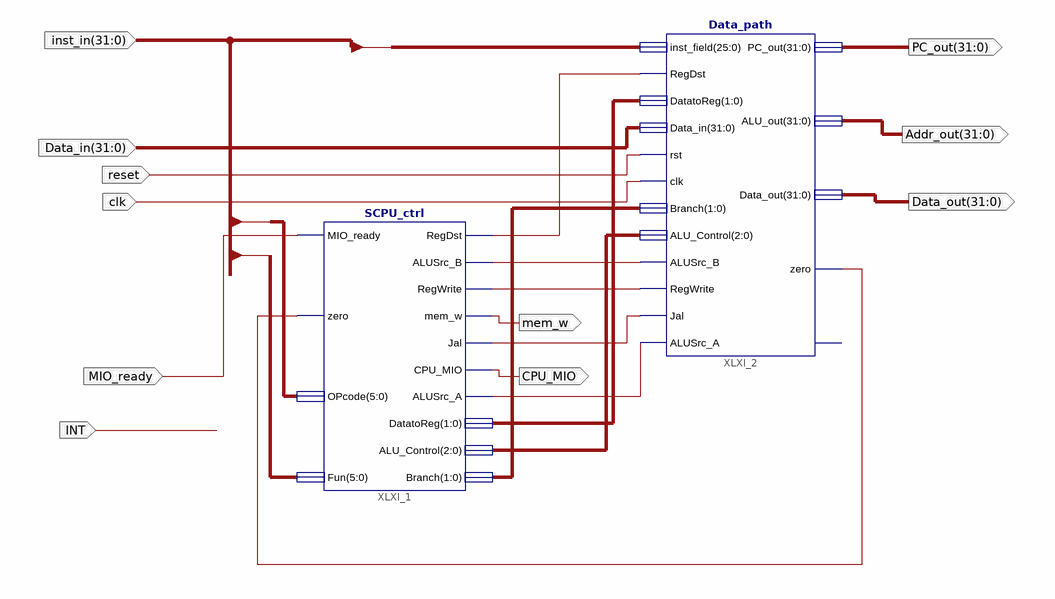
[diagram p0: schematic sheet 1]
// Xilinx ISE schematic SCPU_More.sch (kintex7) as structural Verilog: 2 symbols, 11 ports
module SCPU_More (
  input  clk,
  input  reset,
  input  [31:0] Data_in,
  input  [31:0] inst_in,
  input  INT,
  input  MIO_ready,
  output mem_w,
  output CPU_MIO,
  output [31:0] Addr_out,
  output [31:0] Data_out,
  output [31:0] PC_out
);

  wire XLXN_30, XLXN_32, XLXN_33, XLXN_34, XLXN_35, zero;
  wire [1:0] XLXN_36, XLXN_38;
  wire [2:0] XLXN_37;

  SCPU_ctrl XLXI_1 (
    .MIO_ready(MIO_ready), .zero(zero), .OPcode(inst_in[31:26]), .Fun(inst_in[5:0]), .RegDst(XLXN_30),
    .ALUSrc_B(XLXN_32), .RegWrite(XLXN_33), .mem_w(mem_w), .Jal(XLXN_34), .CPU_MIO(CPU_MIO),
    .ALUSrc_A(XLXN_35), .DatatoReg(XLXN_36), .ALU_Control(XLXN_37), .Branch(XLXN_38));
  Data_path XLXI_2 (
    .inst_field(inst_in[25:0]), .RegDst(XLXN_30), .DatatoReg(XLXN_36), .Data_in(Data_in), .rst(reset),
    .clk(clk), .Branch(XLXN_38), .ALU_Control(XLXN_37), .ALUSrc_B(XLXN_32), .RegWrite(XLXN_33),
    .Jal(XLXN_34), .ALUSrc_A(XLXN_35), .PC_out(PC_out), .ALU_out(Addr_out), .Data_out(Data_out), .zero(zero));  // open: overflow
endmodule
